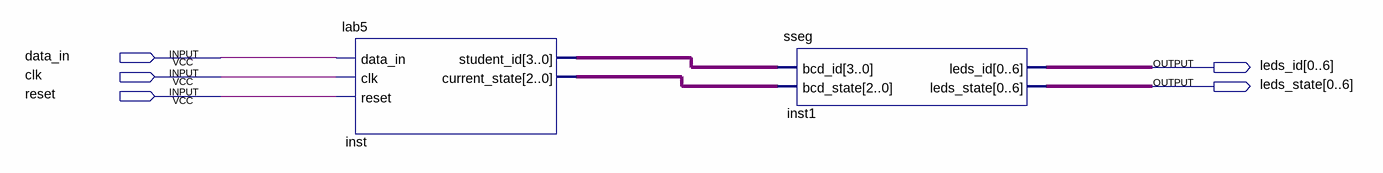
[diagram p0: schematic sheet]
// Quartus schematic blocklab5.bdf as structural Verilog: 2 symbols, 5 pins
module blocklab5 (
  input  data_in,
  input  clk,
  input  reset,
  output [0:6] leds_id,
  output [0:6] leds_state
);

  wire [2:0] inst_current_state;
  wire [3:0] inst_student_id;

  lab5 inst (
    .data_in(data_in), .clk(clk), .reset(reset), .student_id(inst_student_id),
    .current_state(inst_current_state));
  sseg inst1 (.bcd_id(inst_student_id), .bcd_state(inst_current_state), .leds_id(leds_id), .leds_state(leds_state));
endmodule
